# EAGLE design NMEA-WiFi_Bridge_esp01_prod_thl_v3 (EAGLE 7.4.0)
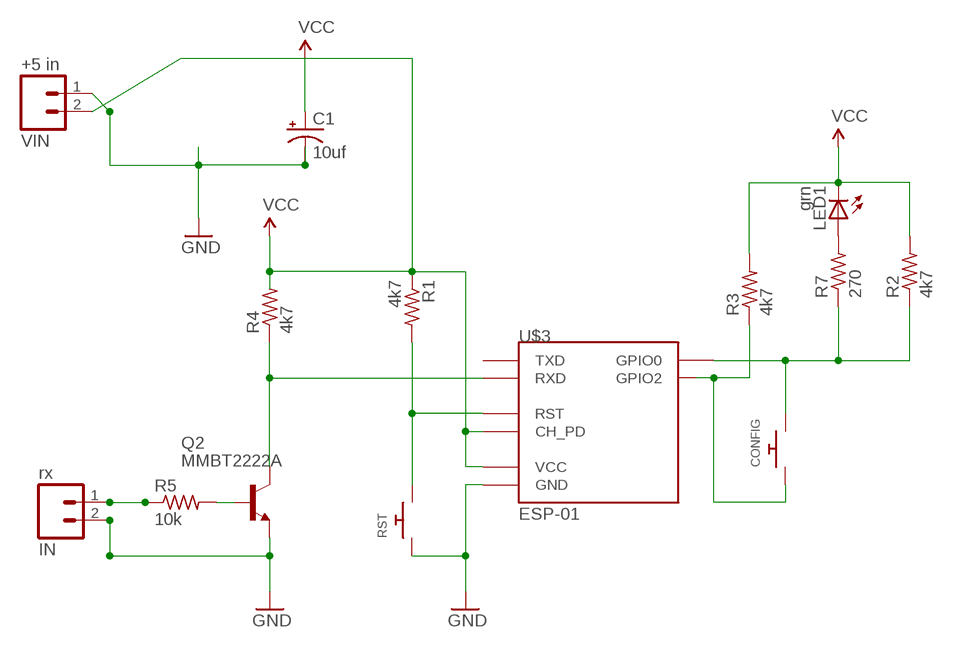
[diagram p0: schematic, sheet 1]

## Parts
C1  10uf  CPOL-USE2.5-6  [E2,5-6]
CONFIG  SWITCH_PUSHBUTTONEVQ-PE  [TACT_PANA-EVQ]
IN  rx  M02POLAR  [MOLEX-1X2]
LED1  grn  LED3MM  [LED3MM]
Q2  MMBT2222A  MPS2222A-NPN-TO92-CBE  [TO92-CBE]
R1  4k7  R-US_0207/2V  [0207/2V]
R2  4k7  R-US_0207/7  [0207/7]
R3  4k7  R-US_0207/7  [0207/7]
R4  4k7  R-US_0207/5V  [0207/5V]
R5  10k  R-US_0207/2V  [0207/2V]
R7  270  R-US_0207/7  [0207/7]
RST  SWITCH_PUSHBUTTONEVQ-PE  [TACT_PANA-EVQ]
U$3  ESP-01  [ESP-01]
VIN  +5 in  M02POLAR  [MOLEX-1X2]

## Nets
GND: C1.- IN.2 Q2.E RST.P$1 U$3.GND VIN.1
GPIO0: CONFIG.P$2 R2.1 R7.1 U$3.GPIO0
N$1: CONFIG.P$1 R3.1 U$3.GPIO2
N$5: Q2.B R5.2
N$6: IN.1 R5.1
N$10: LED1.A R7.2
RST: R1.2 RST.P$2 U$3.RST
RX: Q2.C R4.1 U$3.RX(RXD)
VCC: C1.+ LED1.K(C) R1.1 R2.2 R3.2 R4.2 U$3.CH_PD U$3.VCC VIN.2
Unconnected: U$3.TX(TXD)

## Library data of the parts
C1 = adafruit:CPOL-US: POLARIZED CAPACITOR, American symbol
CONFIG RST = adafruit:SWITCH_PUSHBUTTON: Buttons SOFTTOUCHSMD_SJ - Soft touch temporary push button (Super Junk Akihabara) Compatible with SKPMANE010 [Mouser: 688-SKPMAN] C&K_KSS = Digikey: KSS221GLFS
IN VIN = SparkFun-Connectors:M02: Standard 2-pin 0.1" header. Use with - straight break away headers ( PRT-00116) - right angle break away headers (PRT-00553) - swiss pins (PRT-00743) - machine pins (PRT-00117) - female headers (PRT-00115) Molex polarized connector foot print use with: PRT-08233 with associated crimp pins and housings. 2.54_SCREWTERM for use with PRT-10571. 3.5mm Screw Terminal footprints for PRT-08084 5mm Screw Terminal footprints for use with PRT-08432
LED1 = led:LED: LED OSRAM: - CHIPLED LG R971, LG N971, LY N971, LG Q971, LY Q971, LO R971, LY R971 LH N974, LH R974 LS Q976, LO Q976, LY Q976 LO Q996 - Hyper CHIPLED LW Q18S LB Q993, LB Q99A, LB R99A - SideLED LS A670, LO A670, LY A670, LG A670, LP A670 LB A673, LV A673, LT A673, LW A673 LH A674 LY A675 LS A676, LA A676, LO A676, LY A676, LW A676 LS A679, LY A679, LG A679 - Hyper Micro SIDELED® LS Y876, LA Y876, LO Y876, LY Y876 LT Y87S - SmartLED LW L88C, LW L88S LB L89C, LB L89S, LG L890 LS L89K, LO L89K, LY L89K LS L896, LA L896, LO L896, LY L896 - TOPLED LS T670, LO T670, LY T670, LG T670, LP T670 LSG T670, LSP T670, LSY T670, LOP T670, LYG T670 LG T671, LOG T671, LSG T671 LB T673, LV T673, LT T673, LW T673 LH T674 LS T676, LA T676, LO T676, LY T676, LB T676, LH T676, LSB T676, LW T676 LB T67C, LV T67C, LT T67C, LS T67K, LO T67K, LY T67K, LW E67C LS E67B, LA E67B, LO E67B, LY E67B, LB E67C, LV E67C, LT E67C LW T67C LS T679, LY T679, LG T679 LS T770, LO T770, LY T770, LG T770, LP T770 LB T773, LV T773, LT T773, LW T773 LH T774 LS E675, LA E675, LY E675, LS T675 LS T776, LA T776, LO T776, LY T776, LB T776 LHGB T686 LT T68C, LB T68C - Hyper Mini TOPLED® LB M676 - Mini TOPLED Santana® LG M470 LS M47K, LO M47K, LY M47K Source: http://www.osram.convergy.de LUXEON: - LUMILED® LXK2-PW12-R00, LXK2-PW12-S00, LXK2-PW14-U00, LXK2-PW14-V00 LXK2-PM12-R00, LXK2-PM12-S00, LXK2-PM14-U00 LXK2-PE12-Q00, LXK2-PE12-R00, LXK2-PE12-S00, LXK2-PE14-T00, LXK2-PE14-U00 LXK2-PB12-K00, LXK2-PB12-L00, LXK2-PB12-M00, LXK2-PB14-N00, LXK2-PB14-P00, LXK2-PB14-Q00 LXK2-PR12-L00, LXK2-PR12-M00, LXK2-PR14-Q00, LXK2-PR14-R00 LXK2-PD12-Q00, LXK2-PD12-R00, LXK2-PD12-S00 LXK2-PH12-R00, LXK2-PH12-S00 LXK2-PL12-P00, LXK2-PL12-Q00, LXK2-PL12-R00 Source: www.luxeon.com KINGBRIGHT: KA-3528ASYC Source: www.kingbright.com
Q2 = transistor:*-NPN-: NPN Transistror BF959 corrected 2008.03.06
R1-R4 R7 = adafruit:R-US_: RESISTOR, American symbol
R5 = rcl:R-US_: RESISTOR, American symbol
U$3 = esp8266modules:ESP-01: ESP8266 Wifi Module ESP-01; DIMENSIONS: 14.3 x 24.8 mm; PINS: 8; PITCH: 0.1" / 2.54 mm

## Board
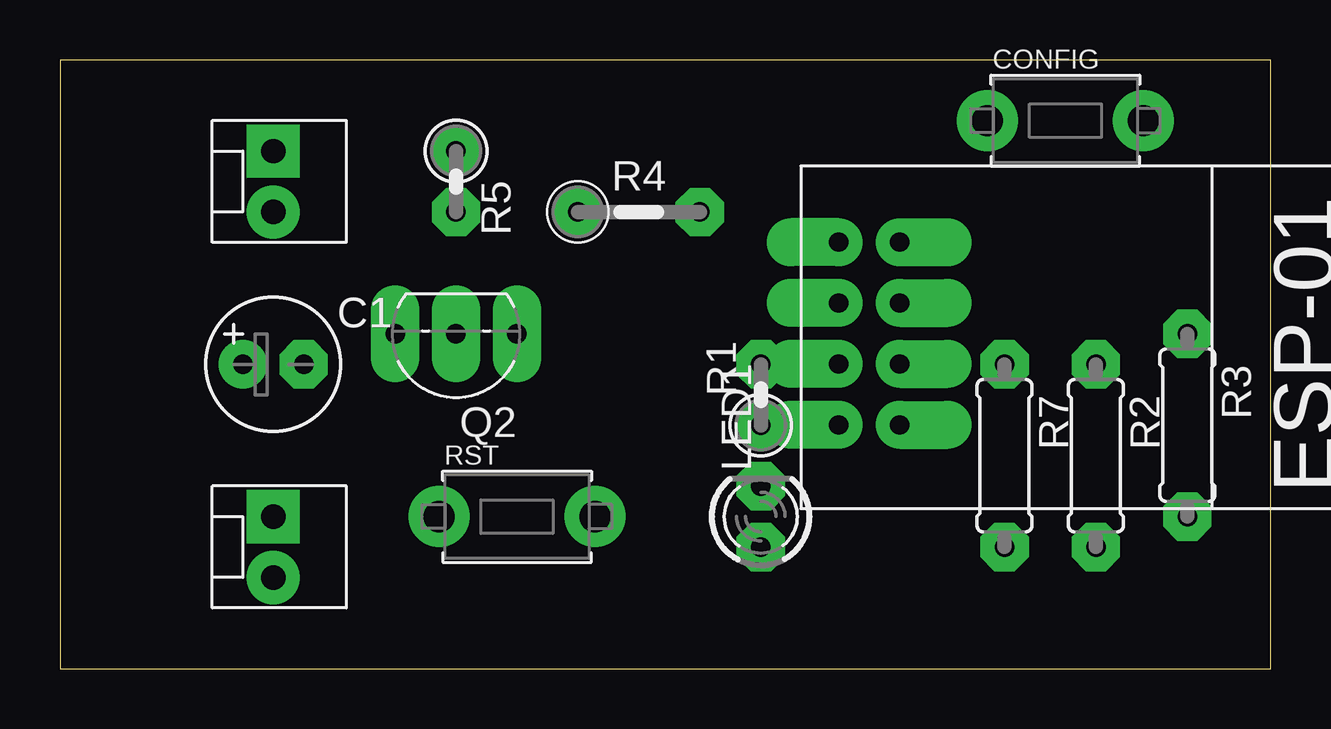
[diagram p1: board, top side]
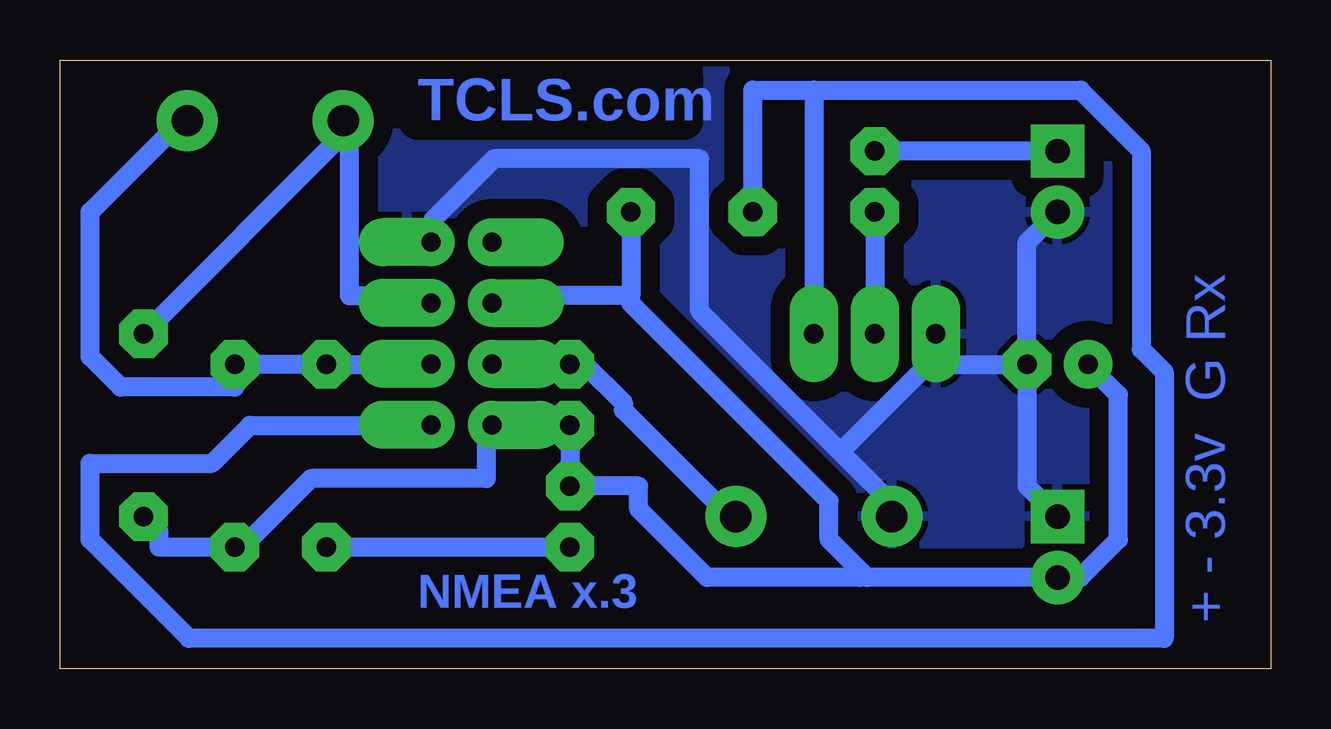
[diagram p2: board, bottom side, seen from below]

Size 50.47 x 25.39 mm. Coordinates in mm from the lower left corner, seen from the top.
Outline: 0,0 50.47,0 50.47,25.39 0,25.39 0,0
Copper layers (1*16): Top 0.035mm / dielectric 1.5mm / Bottom 0.035mm
Design rules "hobby": minimum track width 0.8mm, minimum drill 0.8mm, track to track 0.8mm, track to pad 0.8mm, pad to pad 0.45mm, via to via 0.8mm, smd to smd 8mil, copper to edge 10mil, drill to drill 8mil, minimum pad ring 0.6mm, minimum via ring 0.6mm, stop-mask expansion 0mil, vias tented up to drill 0mil, thermal gap 10mil

### Footprints (pad centres in the part's own frame; a part is rotated, then mirrored left to right if it is on the bottom)
E2,5-6 = drill 0.813 pad 1.778: + -1.27,0 | drill 0.813 pad 1.778 octagon: - 1.27,0
TACT_PANA-EVQ = drill 1.3 pad 2.54: P$1 -3.25,0; P$2 3.25,0
MOLEX-1X2 = drill 1.016 pad 1.88 square: 1 0,0 | drill 1.016 pad 1.88: 2 2.54,0
LED3MM = drill 0.813 octagon: A -1.27,0; K 1.27,0
TO92-CBE = drill 0.813 long: B 0,0; C -2.54,0; E 2.54,0
0207/2V = drill 0.813 pad 1.676 octagon: 1 -1.27,0; 2 1.27,0
0207/7 = drill 0.813 octagon: 1 -3.81,0; 2 3.81,0
0207/5V = drill 0.813 pad 1.676 octagon: 1 -2.54,0; 2 2.54,0
0207/2V' = drill 0.813 octagon: 1 -1.27,0; 2 1.27,0
ESP-01 = drill 0.8 offset: CH_PD -1.285,-8.178; GND -3.825,-5.638; GPIO0 1.255,-5.638; GPIO2 -1.285,-5.638; RST 1.255,-8.178; RX 3.795,-5.638; TX -3.825,-8.178; VCC 3.795,-8.178

### Placement (x,y rotation side)
C1  8.89,12.7 0 top
CONFIG  41.91,22.86 0 top
IN  8.89,21.59 270 top
LED1  29.21,6.35 90 top
Q2  16.51,13.97 180 top
R1  29.21,11.43 90 top
R2  43.18,8.89 270 top
R3  46.99,10.16 270 top
R4  24.13,19.05 0 top
R5  10k  [0207/2V']  16.51,20.32 270 top
R7  39.37,8.89 270 top
RST  19.05,6.35 0 top
U$3  40.64,13.97 270 top
VIN  8.89,6.35 270 top

### Tracks (layer width: path | path; a pad name or v marks a point on that pad's centre or on a via)
GND
  Bottom 0.8: 13.97,12.7 C1.- | Q2.E 13.97,12.7 | VIN.1 10.16,7.62 C1.- | IN.2 10.16,17.78 C1.- | 17.94,9.05 15.88,6.99 15.88,6.35 RST.P$1 | 17.94,9.05 23.81,14.92 23.81,21.27 32.38,21.27 34.92,18.73 34.92,18.1 U$3.GND | 17.94,9.05 14.29,12.7 13.97,12.7
  pour Bottom: 0,0 50.8,0 50.8,25.4 0,25.4
GPIO0
  Bottom 0.8: U$3.GPIO0 35.24,12.7 R7.1 R2.1 43.18,11.75 47.94,11.75 49.21,13.02 49.21,19.05 45.4,22.86 CONFIG.P$2
N$1
  Bottom 0.8: U$3.GPIO2 35.24,15.56 38.42,15.56 38.42,22.86 CONFIG.P$1 38.73,22.23 R3.1
N$5
  Bottom 0.8: R5.2 Q2.B
N$6
  Bottom 0.8: IN.1 R5.1
N$10
  Bottom 0.8: R7.2 LED1.A
RST
  Bottom 0.8: U$3.RST 32.38,12.7 R1.2 28.57,12.7 26.99,11.11 26.99,10.79 22.54,6.35 RST.P$2
RX
  Bottom 0.8: 19.05,24.13 21.59,24.13 R4.1 | 19.05,24.13 7.94,24.13 5.4,21.59 5.4,13.34 4.45,12.38 4.45,1.27 45.09,1.27 49.21,5.4 49.21,8.57 44.13,8.57 42.55,10.16 35.24,10.16 U$3.RX | 19.05,24.13 Q2.C
VCC
  Bottom 0.8: R3.2 46.35,5.71 46.35,5.08 R2.2 42.86,5.08 40.01,7.94 32.7,7.94 32.7,9.84 U$3.VCC 32.38,10.16 R1.1 LED1.K 26.35,7.62 26.35,6.67 23.5,3.81 17.14,3.81 16.99,3.97 | 26.67,15.56 32.38,15.56 U$3.CH_PD | R4.2 26.67,15.56 | C1.+ 6.35,11.43 6.35,5.4 7.94,3.81 VIN.2 16.83,3.81 16.99,3.97 | 16.99,3.97 18.41,5.4 18.41,6.99 26.67,15.24 26.67,15.56

### Text on the board
Bottom: TCLS.com | NMEA x.3 | + - 3.3v G Rx